# Altium schematic sheet Display.SchDoc: Soldeerstation
size A4; DrawnBy: Sem Kirkels; DocumentNumber: 21P001S05; Revision: V1; SheetNumber: 5; SheetTotal: 5
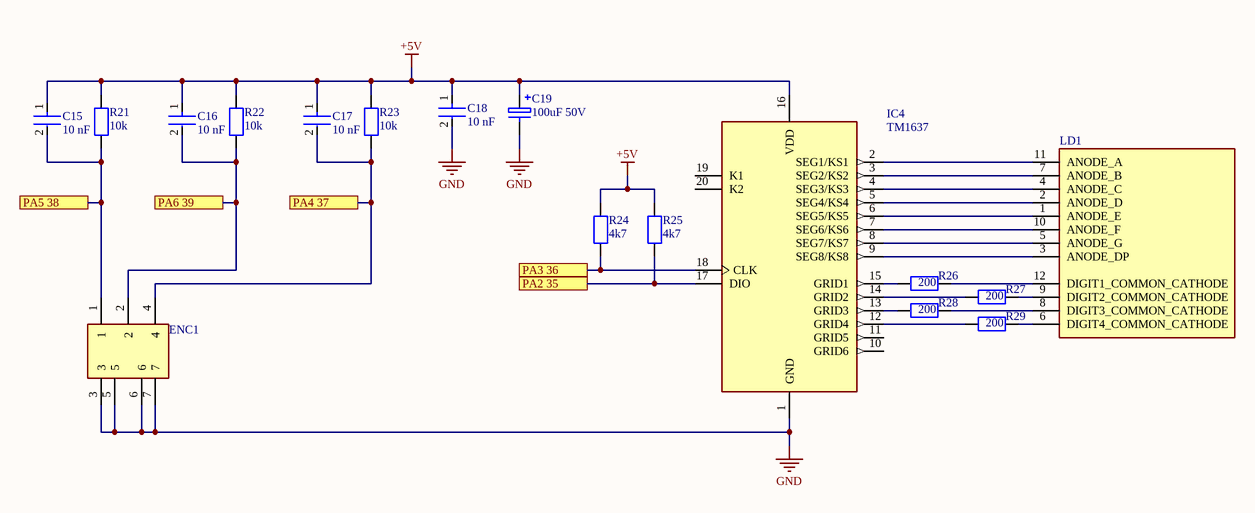
[diagram p0: Display.SchDoc]

## Parts
C15  10 nF  [0805]
C16  10 nF  [0805]
C17  10 nF  [0805]
C18  10 nF  [0805]
C19  100uF 50V  [Elco 100uF 25V]
ENC1  PEC11R-4225F-S0024  [PEC12R-4XXXF-SXXXX_1]  (value not drawn)
IC4  TM1637  [TM1637]
LD1  HDSP-B09G  [7 Segment Display]  (value not drawn)
R21  10k  [0805]
R22  10k  [0805]
R23  10k  [0805]
R24  4k7  [0805]
R25  4k7  [0805]
R26  200  [0805]
R27  200  [0805]
R28  200  [0805]
R29  200  [0805]

## Ports
PA2 35, PA3 36, PA4 37, PA5 38, PA6 39

## Nets
+5V: C15.1 C16.1 C17.1 C18.1 C19.1 IC4.16(VDD) R21.1 R22.1 R23.1 R24.1 R25.1
GND: C18.2 C19.2 ENC1.3 ENC1.5 ENC1.6 ENC1.7 IC4.1(GND)
PA2 35: IC4.17(DIO) R25.2 ; port PA2 35
PA3 36: IC4.18(CLK) R24.2 ; port PA3 36
PA4 37: C17.2 ENC1.4 R23.2 ; port PA4 37
PA5 38: C15.2 ENC1.1 R21.2 ; port PA5 38
PA6 39: C16.2 ENC1.2 R22.2 ; port PA6 39
NetIC4_2: IC4.2(SEG1/KS1) LD1.11(ANODE_A)
NetIC4_3: IC4.3(SEG2/KS2) LD1.7(ANODE_B)
NetIC4_4: IC4.4(SEG3/KS3) LD1.4(ANODE_C)
NetIC4_5: IC4.5(SEG4/KS4) LD1.2(ANODE_D)
NetIC4_6: IC4.6(SEG5/KS5) LD1.1(ANODE_E)
NetIC4_7: IC4.7(SEG6/KS6) LD1.10(ANODE_F)
NetIC4_8: IC4.8(SEG7/KS7) LD1.5(ANODE_G)
NetIC4_9: IC4.9(SEG8/KS8) LD1.3(ANODE_DP)
NetIC4_12: IC4.12(GRID4) R29.1
NetIC4_13: IC4.13(GRID3) R28.1
NetIC4_14: IC4.14(GRID2) R27.1
NetIC4_15: IC4.15(GRID1) R26.1
NetLD1_6: LD1.6(DIGIT4_COMMON_CATHODE) R29.2
NetLD1_8: LD1.8(DIGIT3_COMMON_CATHODE) R28.2
NetLD1_9: LD1.9(DIGIT2_COMMON_CATHODE) R27.2
NetLD1_12: LD1.12(DIGIT1_COMMON_CATHODE) R26.2

Not connected (* = marked no-connect by the designer): IC4 10(GRID6) 11(GRID5) 19(K1) 20(K2)

## Library data of the parts
C15-C18 = Condensator 0805: Chip Multilayer Ceramic Capacitors for General Purpose, 0805, 10uF, X5R, 15%, 10%, 25V; Length: 2mm; Depth: 1.25mm; Termination: SMD/SMT; Voltage: 25V; Height: 1.25mm; Material: Ceramic; Thickness: 0.053inch; Radiation Hardening: No; Min Operating Temperature: -55°C; Width: 0.049inch; Package Quantity: 1; Mount: Surface Mount; Dielectric: X5R; Packaging: Tape and Reel; Capacitance: 10uF; Voltage Rating (DC): 25V; Lead Free: Lead Free; Max Operating Temperature: 85°C; Case Code (Imperial): 0805; Case/Package: 0805; Tolerance: 10%; Voltage Rating: 25V; Case Code (Metric): 2012
C19 = Condensator Elco: Part Number: 02015A270JAT2A; Manufacturer: AVX Interconnect / Elco
ENC1 = Encoder: Undefined or Miscellaneous; Manufacturer_Name: Bourns; Datasheet Link: https://componentsearchengine.com//PEC11R-4225F-S0024.pdf; Mouser2 Part Number: 652-PEC11R-4225F-S24; Mouser2 Price/Stock: https://www.mouser.com/Search/Refine.aspx?Keyword=652-PEC11R-4225F-S24; Manufacturer_Part_Number: PEC11R-4225F-S0024
IC4 = TM1637: LED Drive Control Special Circuit; MF: Titan Micro Electronics; Package: Package; Availability: Not in stock; SnapEDA_Link: https://www.snapeda.com/parts/TM1637/Titan+Micro+Electronics/view-part/?ref=snap; MP: TM1637; Check_prices: https://www.snapeda.com/parts/TM1637/Titan+Micro+Electronics/view-part/?ref=eda; Value: *; Price: None
LD1 = 7 Segment Display: Display Modules - LED Character and Numeric Green 7-Segment Clock 4 Character Common Cathode 2.2V 20mA 0.752 H x 2.016 W x 0.315 D _19.10mm x 51.20mm x 8.00mm_ 12-DIP _0.600, 15.24mm_; MF: Broadcom Limited; Package: DIP-12 Broadcom; MP: HDSP-B09G; Value: *; Availability: Unavailable; SnapEDA_Link: https://www.snapeda.com/parts/HDSP-B09G/Broadcom%20Limited/view-part/1797524/?ref=snap; Price: None
R21-R29 = Resistor 0805: Manufacturer: Vishay Dale; Part Number: CRCW08050000Z0EA